# Altium schematic sheet Traitement_pwm.SchDoc
size A4; SheetNumber: 1; SheetTotal: 1; SPICEModelCacheBINGQINI: <root> / <DocumentId>BINGQINI</DocumentId> / <CacheFrame Number="0"> / <Model Name="lf353" Kind="CKT"> / <Text>*////////////////////////////////////////////////////////// / *LF353 Wide Bandwidth Dual JFET-Input OP-AMP MACRO-MODEL / *////////////////////////////////////////////////////////// / * / * connections:    non-inverting input / *                 |   inverting input / *                 |   |   positive power supply / *                 |   |   |   negative power supply / *                 |   |   |   |   output / *                 |   |   |   |   | / *                 |   |   |   |   | / .SUBCKT LF353     1   2  99  50  28 / * / * PINOUT ORDER +IN -IN V+ V- OUT / * / * / *Features: / *Low supply current =                1.8mA / *Wide bandwidth =                     4MHz / *High slew rate =                   13V/uS / *Low offset voltage =                 10mV / * / *NOTE: Model is for single device only and simulated / *      supply current is 1/2 of total device current. / * / ****************INPUT STAGE************** / * / IOS 2 1 25P / *^Input offset current / R1 1 3 1E12 / R2 3 2 1E12 / I1 99 4 100U / J1 5 2 4 JX / J2 6 7 4 JX / R3 5 50 20K / R4 6 50 20K / *Fp2=12 MHz / C4 5 6 3.31573E-13 / * / ***********COMMON MODE EFFECT*********** / * / I2 99 50 1.7MA / *^Quiescent supply current / EOS 7 1 POLY(1) 16 49 5E-3 1 / *Input offset voltage.^ / R8 99 49 50K / R9 49 50 50K / * / *********OUTPUT VOLTAGE LIMITING******** / V2 99 8 2.13 / D1 9 8 DX / D2 10 9 DX / V3 10 50 2.13 / * / **************SECOND STAGE************** / * / EH 99 98 99 49 1 / F1 9 98 POLY(1) VA3 0 0 0 1.0985E7 / G1 98 9 5 6 1E-3 / R5 98 9 100MEG / VA3 9 11 0 / *Fp1=40.3 HZ / C3 98 11 39.493P / * / ***************POLE STAGE*************** / * / *Fp3=42 MHz / G3 98 15 9 49 1E-6 / R12 98 15 1MEG / C5 98 15 3.7894E-15 / * / *********COMMON-MODE ZERO STAGE********* / * / G4 98 16 3 49 1E-8 / L2 98 17 31.831M / R13 17 16 1K / * / **************OUTPUT STAGE************** / * / F6  99 50 VA7 1 / F5  99 23 VA8 1 / D5  21 23 DX / VA7 99 21 0 / D6  23 99 DX / E1  99 26 99 15 1 / VA8 26 27 0 / R16 27 28 35 / V5  28 25 0.1V / D4  25 15 DX / V4  24 28 0.1V / D3  15 24 DX / * / ***************MODELS USED************** / * / .MODEL DX D(IS=1E-15) / .MODEL JX PJF(BETA=1.25E-5 VTO=-2.00 IS=50E-12) / * / .ENDS</Text> / </Model> / </CacheFrame> / </root>
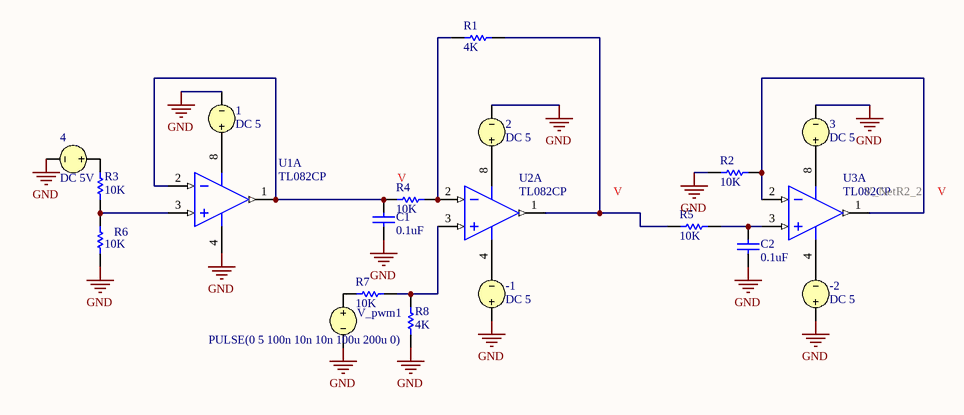
[diagram p0: Traitement_pwm.SchDoc]

## Parts
1  DC 5
2  DC 5
3  DC 5
4  DC 5V
-1  DC 5
-2  DC 5
C1  value 0.1uF  (hidden comment: Capacitor)
C2  value 0.1uF  (hidden comment: Capacitor)
R1  value 4K  (hidden comment: Resistor)
R2  value 10K  (hidden comment: Resistor)
R3  value 10K  (hidden comment: Resistor)
R4  value 10K  (hidden comment: Resistor)
R5  value 10K  (hidden comment: Resistor)
R6  value 10K  (hidden comment: Resistor)
R7  value 10K  (hidden comment: Resistor)
R8  value 4K  (hidden comment: Resistor)
U1  TL082CP  [N08E]  (part A of 2)
U2  TL082CP  [N08E]  (part A of 2)
U3  TL082CP  [N08E]  (part A of 2)
V_pwm1  PULSE(0 5 100n 10n 10n 100u 200u 0)

## Nets
GND: 1.2 2.2 3.2 4.2 -1.1 -2.1 C1.1 C2.1 R2.1 R6.1 R8.2 U1.4(V-) V_pwm1.2
Net1_1: 1.1 U1.8(V+)
Net2_1: 2.1 U2.8(V+)
Net3_1: 3.1 U3.8(V+)
Net4_1: 4.1 R3.1
Net-1_2: -1.2 U2.4(V-)
Net-2_2: -2.2 U3.4(V-)
NetC1_2: C1.2 R4.1 U1.1(OUTA) U1.2(INA-)
NetC2_2: C2.2 R5.2 U3.3(INA+)
NetR1_1: R1.1 R4.2 U2.2(INA-)
NetR1_2: R1.2 R5.1 U2.1(OUTA)
NetR2_2: R2.2 U3.1(OUTA) U3.2(INA-)
NetR3_2: R3.2 R6.2 U1.3(INA+)
NetR7_1: R7.1 V_pwm1.1
NetR7_2: R7.2 R8.1 U2.3(INA+)

## Library data of the parts
1-3 -1 -2 = VSRC: Voltage Source; Note: PCB Footprint - Not required; AC Magnitude: 1; AC Phase: 0; Value: 5; Published: 8-Jun-2000; LatestRevisionDate: 17-Jul-2002; LatestRevisionNote: Re-released for DXP Platform.; PackageReference: Not Applicable; Publisher: Altium Limited
4 = VSRC: Voltage Source; Note: PCB Footprint - Not required; AC Magnitude: 1; AC Phase: 0; Published: 8-Jun-2000; LatestRevisionDate: 17-Jul-2002; LatestRevisionNote: Re-released for DXP Platform.; PackageReference: Not Applicable; Publisher: Altium Limited; Value: 5V
C1 C2 = Capacitor: SimulationGenericComponent: True
R1-R8 = Resistor: TC1: 0; SimulationGenericComponent: True; TC2: 0
U1-U3 = TL082CP: Wide Bandwidth Dual JFET Input Operational Amplifier, 8-pin MDIP; Manufacturer: National Semiconductor; PackageTopMarking: NSUZXYTTE#*TL082*CP; PowerWise: N; CompType: Amplifiers; Published: 4-Dec-2008; LatestRevisionDate: 13-Jan-2009; LatestRevisionNote: Sim Model Added.; DatasheetVersion: Aug-2000; PackageVersion: revG, May-2006; PackageReference: N08E; Publisher: Altium Limited; PackageDescription: MDIP, .365 x .250 x .130in, 8 Lead, .100in Pitch; PartNumber: TL082CP; RoHS: N; PinCount: 8; Code_JEDEC: MS-001-BA; ComponentLink1Description: TL082 Datasheet; ComponentLink1URL: http://www.national.com/ds/TL/TL082.pdf; ComponentLink2Description: TL082 Web Page; ComponentLink2URL: http://www.national.com/pf/TL/TL082.html; ComponentLink3Description: N08E Package Page; ComponentLink3URL: http://www.national.com/packaging/folders/n08e.html
V_pwm1 = VSRC: Voltage Source; Note: PCB Footprint - Not required; AC Magnitude: 1; AC Phase: 0; DC Magnitude: 5; Published: 8-Jun-2000; LatestRevisionDate: 17-Jul-2002; LatestRevisionNote: Re-released for DXP Platform.; PackageReference: Not Applicable; Publisher: Altium Limited; Initial Value: 0; Pulsed Value: 5; Time Delay: 100n; Rise Time: 10n; Fall Time: 10n; Pulse Width: 100u; Period: 200u; Phase: 0